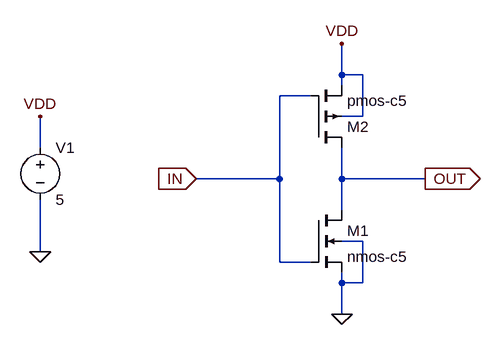
[diagram p0: schematic Inverter.asc]
Inverter.asc, the LTspice schematic file:
Version 4
SHEET 1 880 680
WIRE 496 112 496 64
WIRE 528 112 496 112
WIRE 496 128 496 112
WIRE 448 144 400 144
WIRE 528 176 528 112
WIRE 528 176 496 176
WIRE 32 224 32 176
WIRE 400 272 400 144
WIRE 400 272 272 272
WIRE 496 272 496 224
WIRE 624 272 496 272
WIRE 496 320 496 272
WIRE 528 368 496 368
WIRE 32 384 32 304
WIRE 400 400 400 272
WIRE 448 400 400 400
WIRE 496 432 496 416
WIRE 528 432 528 368
WIRE 528 432 496 432
WIRE 496 480 496 432
FLAG 496 480 0
FLAG 496 64 VDD
FLAG 624 272 OUT
IOPIN 624 272 Out
FLAG 272 272 IN
IOPIN 272 272 In
FLAG 32 384 0
FLAG 32 176 VDD
SYMBOL nmos4 448 320 R0
SYMATTR InstName M1
SYMATTR Value nmos-c5
SYMATTR Value2 l=1u w=1u
SYMBOL pmos4 448 224 M180
SYMATTR InstName M2
SYMATTR Value pmos-c5
SYMATTR Value2 l=1u w=1.5u
SYMBOL voltage 32 208 R0
SYMATTR InstName V1
SYMATTR Value 5

The netlist it stands for:
* Inverter.asc
M1 OUT IN 0 0 nmos-c5 l=1u w=1u
M2 OUT IN VDD VDD pmos-c5 l=1u w=1.5u
V1 VDD 0 5
.model NMOS NMOS
.model PMOS PMOS
.lib standard.mos
.backanno
.end